# Altium schematic sheet CompareVoltage.SchDoc
size B
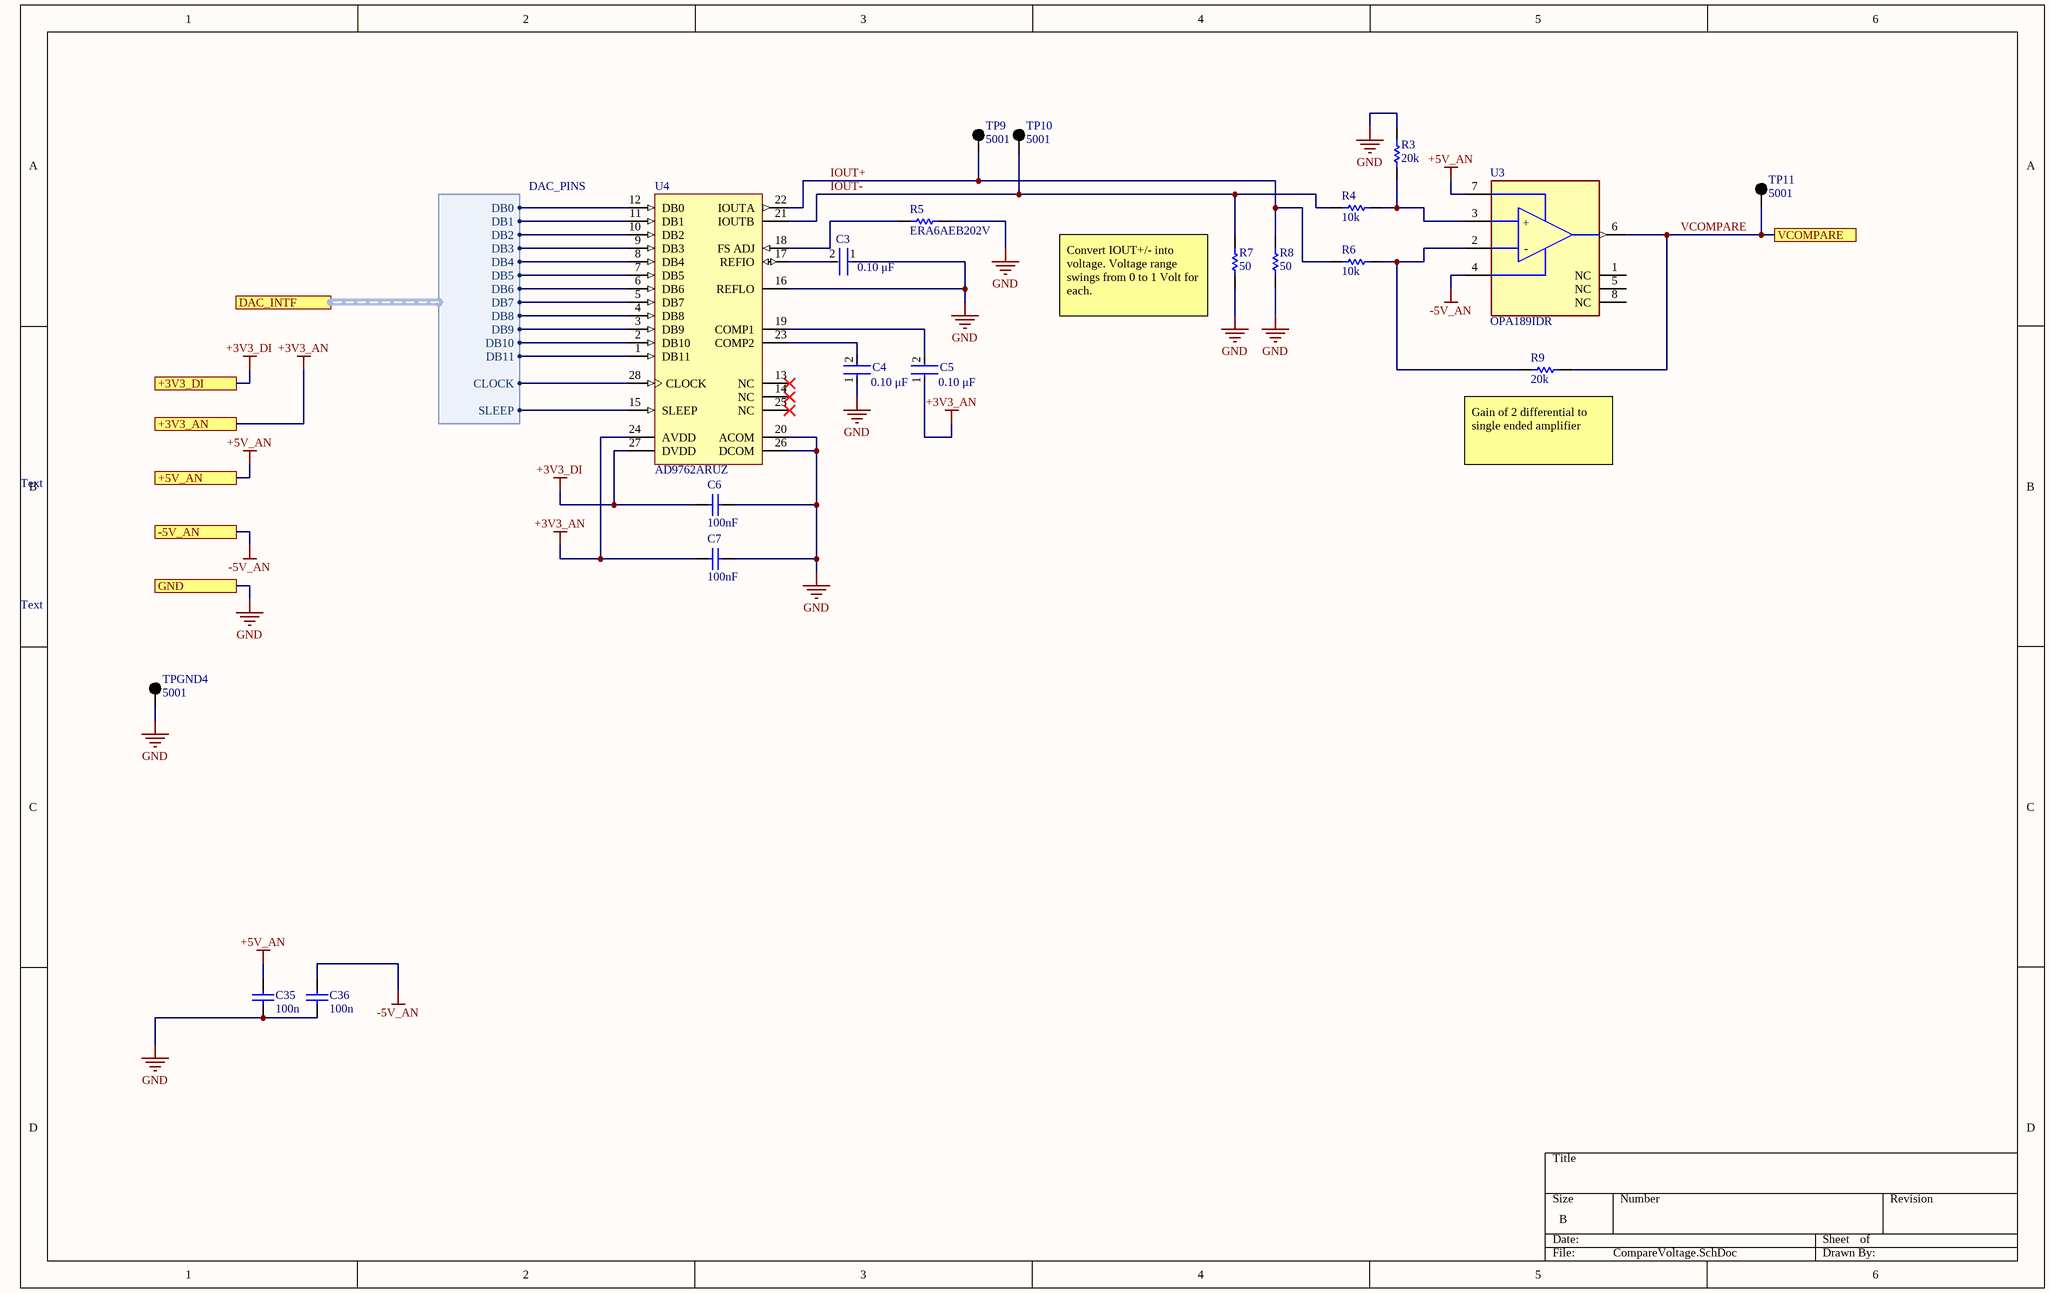
[diagram p0: CompareVoltage.SchDoc]

## Parts
C3  value 0.10 μF  [FP-C1206C-EB-MFG]  (hidden comment: C1206C104J3GACTU)
C4  value 0.10 μF  [FP-C1206C-EB-MFG]  (hidden comment: C1206C104J3GACTU)
C5  value 0.10 μF  [FP-C1206C-EB-MFG]  (hidden comment: C1206C104J3GACTU)
C6  Capacitance: 100nF  [CAPC1608X90X40ML10T20]  (hidden comment: CC0603KRX7R9BB104)
C7  Capacitance: 100nF  [CAPC1608X90X40ML10T20]  (hidden comment: CC0603KRX7R9BB104)
C35  value 100n  [CAPC2013X88X50NL20T25]  (hidden comment: C0805C104K5RACTU)
C36  value 100n  [CAPC2013X88X50NL20T25]  (hidden comment: C0805C104K5RACTU)
R3  20k  [RESC1609X50X30LL10T20]
R4  10k  [RESC1609X50X30NL8T20]
R5  ERA6AEB202V  [RESC2013X60X40ML20T25]
R6  10k  [RESC1609X50X30NL8T20]
R7  Resistance: 50  [RESC1609X50X30NL10T20]  (hidden comment: CRCW060350R0FKEA)
R8  Resistance: 50  [RESC1609X50X30NL10T20]  (hidden comment: CRCW060350R0FKEA)
R9  20k  [RESC1609X50X30LL10T20]
TP9  5001  [KSTN-5001]
TP10  5001  [KSTN-5001]
TP11  5001  [KSTN-5001]
TPGND4  5001  [KSTN-5001]
U3  OPA189IDR  [FP-D0008A-MFG]
U4  AD9762ARUZ  [RU-28_L]

## Ports
+3V3_AN, +3V3_DI, +5V_AN, -5V_AN, DAC_INTF (harness DAC_PINS), GND, VCOMPARE

## Harnesses
DAC_PINS: DB0, DB1, DB2, DB3, DB4, DB5, DB6, DB7, DB8, DB9, DB10, DB11, CLOCK, SLEEP

## Nets
+3V3_AN: C5.1 C7.2 U4.24(AVDD) ; port +3V3_AN
+3V3_DI: C6.2 U4.27(DVDD) ; port +3V3_DI
+5V_AN: C35.2 U3.7(V+) ; port +5V_AN
-5V_AN: C36.2 U3.4(V-) ; port -5V_AN
GND: C3.1 C4.1 C6.1 C7.1 C35.1 C36.1 R3.2 R5.2 R7.1 R8.1 TPGND4.1 U4.16(REFLO) U4.20(ACOM) U4.26(DCOM) ; port GND
IOUT+: R6.1 R8.2 TP9.1 U4.22(IOUTA)
IOUT-: R4.1 R7.2 TP10.1 U4.21(IOUTB)
VCOMPARE: R9.2 TP11.1 U3.6(OUT) ; port VCOMPARE
NetC3_2: C3.2 U4.17(REFIO)
NetC4_2: C4.2 U4.23(COMP2)
NetC5_2: C5.2 U4.19(COMP1)
NetR3_1: R3.1 R4.2 U3.3(+IN)
NetR5_1: R5.1 U4.18(FS_ADJ)
NetR6_2: R6.2 R9.1 U3.2(-IN)
NetU4_1: U4.1(DB11) ; port DAC_INTF.DB11
NetU4_2: U4.2(DB10) ; port DAC_INTF.DB10
NetU4_3: U4.3(DB9) ; port DAC_INTF.DB9
NetU4_4: U4.4(DB8) ; port DAC_INTF.DB8
NetU4_5: U4.5(DB7) ; port DAC_INTF.DB7
NetU4_6: U4.6(DB6) ; port DAC_INTF.DB6
NetU4_7: U4.7(DB5) ; port DAC_INTF.DB5
NetU4_8: U4.8(DB4) ; port DAC_INTF.DB4
NetU4_9: U4.9(DB3) ; port DAC_INTF.DB3
NetU4_10: U4.10(DB2) ; port DAC_INTF.DB2
NetU4_11: U4.11(DB1) ; port DAC_INTF.DB1
NetU4_12: U4.12(DB0) ; port DAC_INTF.DB0
NetU4_15: U4.15(SLEEP) ; port DAC_INTF.SLEEP
NetU4_28: U4.28(CLOCK) ; port DAC_INTF.CLOCK

Not connected (* = marked no-connect by the designer): U3 1(NC) 5(NC) 8(NC); U4 13(NC)* 14(NC)* 25(NC)*

## Notes on the sheet
- (near R7) Convert IOUT+/- into voltage. Voltage range swings from 0 to 1 Volt for each.
- Text
- (near R9) Gain of 2 differential to single ended amplifier
- (in symbol CMP-04895-000042-1) +; -

## Library data of the parts
C3-C5 = CMP-03020-000180-1: CAP CER 0.1UF 25V 5% NP0 1206; Manufacturer: KEMET; Tolerance: 0.05; Temperature Coefficient: 15%; Automotive Grade: Grade 0; Material: Ceramic; Temperature Characteristic: C0G; Automotive: Yes; Ipc Land Pattern Name: CAPC320160X78; ComponentLink2Description: Datasheet; Height: 0.88mm; Digikey Description: CAP CER 0.1UF 25V 5% NP0 1206; Capacitance: 0.10 μF; Category: Cap; Package: C1206C-EB; Device Class L3: Ceramic Capacitors; Octopart: https://octopart.com/c1206c104j3gactu-kemet-9145095; Device Class L1: Passive Components; Device Class L2: Capacitors; Voltage Rating: 25 V; Lead Free: Yes; Mouser Description: Multilayer Ceramic Capacitors MLCC - SMD/SMT 25volts 0.1uF 5% C0G; Temperature: -55°C to +150°C; ComponentLink2URL: https://content.kemet.com/datasheets/KEM_C1007_X8R_ULTRA_150C_SMD.pdf; RoHS: TRUE; Temperature Range High: +150°C; Temperature Range Low: -55°C; Manufacturer Part Number: C1206C104J3GACTU
C6 C7 = CMP-2100-03601-1: Chip Capacitor, 100 nF, +/- 10%, 50 V, -55 to 125 degC, 0603 (1608 Metric), RoHS, Tape and Reel; Manufacturer: Yageo; Voltage Rating: 50V; Dielectric: X7R; Dielectric Material: Ceramic; Case Code (Metric): 1608; Tolerance: 10%; Lead Free: LeadFree; Case/Package: 0603; REACH SVHC: NoSVHC; Length: 1.6mm; RoHSCompliant: True; Manufacturer URL: http://www.yageo.com/; Datasheet URL: http://www.yageo.com/documents/recent/UPY-GPHC_X7R_6.3V-to-50V_15.pdf; Packaging: TapeandReel; Case Code (Imperial): 0603; Thickness: 0.035inch; Radiation Hardening: No; Height: 0.8mm; Datasheet Version: Rev. 15, 10/2016; Package Reference: 0603; Package Quantity: 1; Min Operating Temperature: -55degC; Package Description: 2-Pin Surface Mount Device, Body 1.6 x 0.8 mm; Number of Pins: 2; Max Operating Temperature: 125degC; Depth: 0.8mm; Termination: SMD/SMT; Voltage: 50V; Width: 0.031inch
C35 C36 = CMP-2007-00279-1: Manufacturer: Kemet; Part Number: C0805C104K5RACTU
R3 R9 = CMP-2000-03068-1: Manufacturer: Vishay Dale; Part Number: CRCW060320K0FKEA
R4 R6 = CMP-1666-00005-4: Chip Resistor, 10 KOhm, +/- 1%, 100 mW, -55 to 155 degC, 0603 (1608 Metric), RoHS, Tape and Reel; Manufacturer: Vishay Semiconductor; Voltage Rating: 75 V; Max Operating Temperature: 155 degC; PackageDescription: 2-Pin Surface Mount Device, Body 1.575 x 0.85 mm; ComponentLink1Description: Manufacturer URL; RoHSCompliant: true; PackageReference: 0603; REACH SVHC: Unknown; Length: 1.55 mm; DatasheetVersion: 06/2012; Packaging: Tape and Reel; Min Operating Temperature: -55 degC; Mounting Technology: Surface Mount; ComponentLink2URL: https://datasheet.ciiva.com/11809/0900766b80d98afc-11809037.pdf; Height: 0.45 mm; ComponentLink2Description: Datasheet; Package Quantity: 5000; ComponentLink1URL: http://www.vishay.com/
R5 = CMP-2001-00609-1: Manufacturer: Panasonic; Part Number: ERA6AEB202V
R7 R8 = CMP-2000-03436-1: Manufacturer: Vishay Dale; Part Number: CRCW060350R0FKEA
TP9-TP11 TPGND4 = CMP-2000-05181-1: Test Point, Black, 1-Pin THD, RoHS, Bulk; Manufacturer: Keystone; Other Names: 5001K; Catalog Drawings: 5000Series; Alternate Color: 5004K-ND / -TESTPOINTPCMINI.040"DYELLOW / 5003K-ND / -TESTPOINTPCMINI.040"DORANGE / 5002K-ND / -TESTPOINTPCMINI.040"DWHITE / 5000K-ND / -TESTPOINTPCMINI.040"DRED; Kits: DKTGRS232C-KIT-ND / -TTLCONVERTER; Online Catalog: ColorCodedTestPoints; Datasheet URL: https://ciiva.com/datasheet-click-2917627?src=ciiva&sig=bd195616; Mounting Type: 0.040"(1.02mm)HoleDiameter; Family: TestPoints; RoHS Information: RoHSComplianceStatement; Datasheet Version: Rev. G, 12/2008; Color: Black; Category: TestandMeasurement; Standard Package: 100; Manufacturer URL: http://www.keyelco.com/; Material: Base,Nylon46,UL94V-0; Type: PCTestPoint,Miniature; Terminal: 0.010"x0.020"(0.25mmx0.51mm)PhosphorBronzeWire,SilverPlated; Series: THM; Packaging: Bulk
U3 = CMP-04895-000042-1: 36V ZERO DRIFT OP-AMP; Manufacturer: Texas Instruments; Input Offset Voltage: 0.0004mV; Max Dual Supply Voltage: 18V; Number Of Channels: 1; Min Dual Supply Voltage: 2.25V; Nominal Supply Current: 1.3mA; Max Junction Temp: +150°C; Standoff Height: 0.11mm; Output Current Per Channel: 65mA; Voltage Gain: 170dB; Gain Bandwidth: 14MHz; Min Supply Voltage: 4.5V; Input Bias Current: 0.00007uA; Manufacturer Part Number: OPA189IDR; Category: IC; Max Supply Voltage: 36V; Mouser Description: Op Amp Single Zero Drift Amplifier R-R O/P ±18V/36V 8-Pin SOIC T/R; Device Class L1: Integrated Circuits (ICs); RoHS: TRUE; Ipc Land Pattern Name: SOIC127P600X175-8; Ambient Temperature Range Low: -40°C; ComponentLink2URL: http://www.ti.com/lit/ds/symlink/opa189.pdf; Automotive: No; Device Class L3: Amplifiers - Op Amps; ComponentLink2Description: Datasheet; Temperature: -40°C to +125°C; Lead Free: Yes; Temperature Range High: +125°C; Height: 1.75mm; Ambient Temperature Range High: +125°C; Temperature Range Low: -40°C; Package: D0008A; Octopart: https://octopart.com/opa189idr-texas+instruments-84619764; Device Class L2: Linear ICs; Digikey Description: 36V ZERO DRIFT OP-AMP
U4 = CMP-0318-01862-2: Single 12-Bit TxDAC, 125 Msps, -40 to +85 degC, RU-28, Pb-Free, Tube; Generic Part Number: AD9762; Manufacturer: Analog Devices; # DAC Outputs: 1; Single Supply: Yes; Resolution (Bits): 12; Settling Time: 35ns; Max V+: 5.5V; Op Pwr Diss: 160mW; PackageVersion: 2005; RevisionNote: Component URL fixed; Code_JEDEC: MO-153-AE; PackageReference: RU-28; Packing: Tube; DatasheetVersion: Rev.B; RoHS: Y; Mounting Technology: Surface Mount; PartNumber: AD9762ARUZ; ComponentLink2Description: Datasheet; ComponentLink2URL: http://www.analog.com/static/imported-files/data_sheets/AD9762.pdf; PackageDescription: 28-Lead Thin Shrink Small Outline Package [TSSOP]; ComponentLink3Description: Package Specification; ComponentLink4Description: Product URL; ComponentLink3URL: http://www.analog.com/static/imported-files/packages/249854663RU_28.pdf; ComponentLink4URL: http://www.analog.com/en/digital-to-analog-converters/da-converters/ad9762/products/product.html; ComponentLink1URL: http://www.analog.com/en/index.html; ComponentLink1Description: Manufacturer URL